# Altium schematic sheet CV_GATE_Current_Buffer.SchDoc: MIDI-CV Converter: GPIO Buffers
size Letter; Engineer: Nicholas Morrow; DocumentNumber: 2; SheetNumber: 2; SheetTotal: 5; Project: GARY Synthesizer
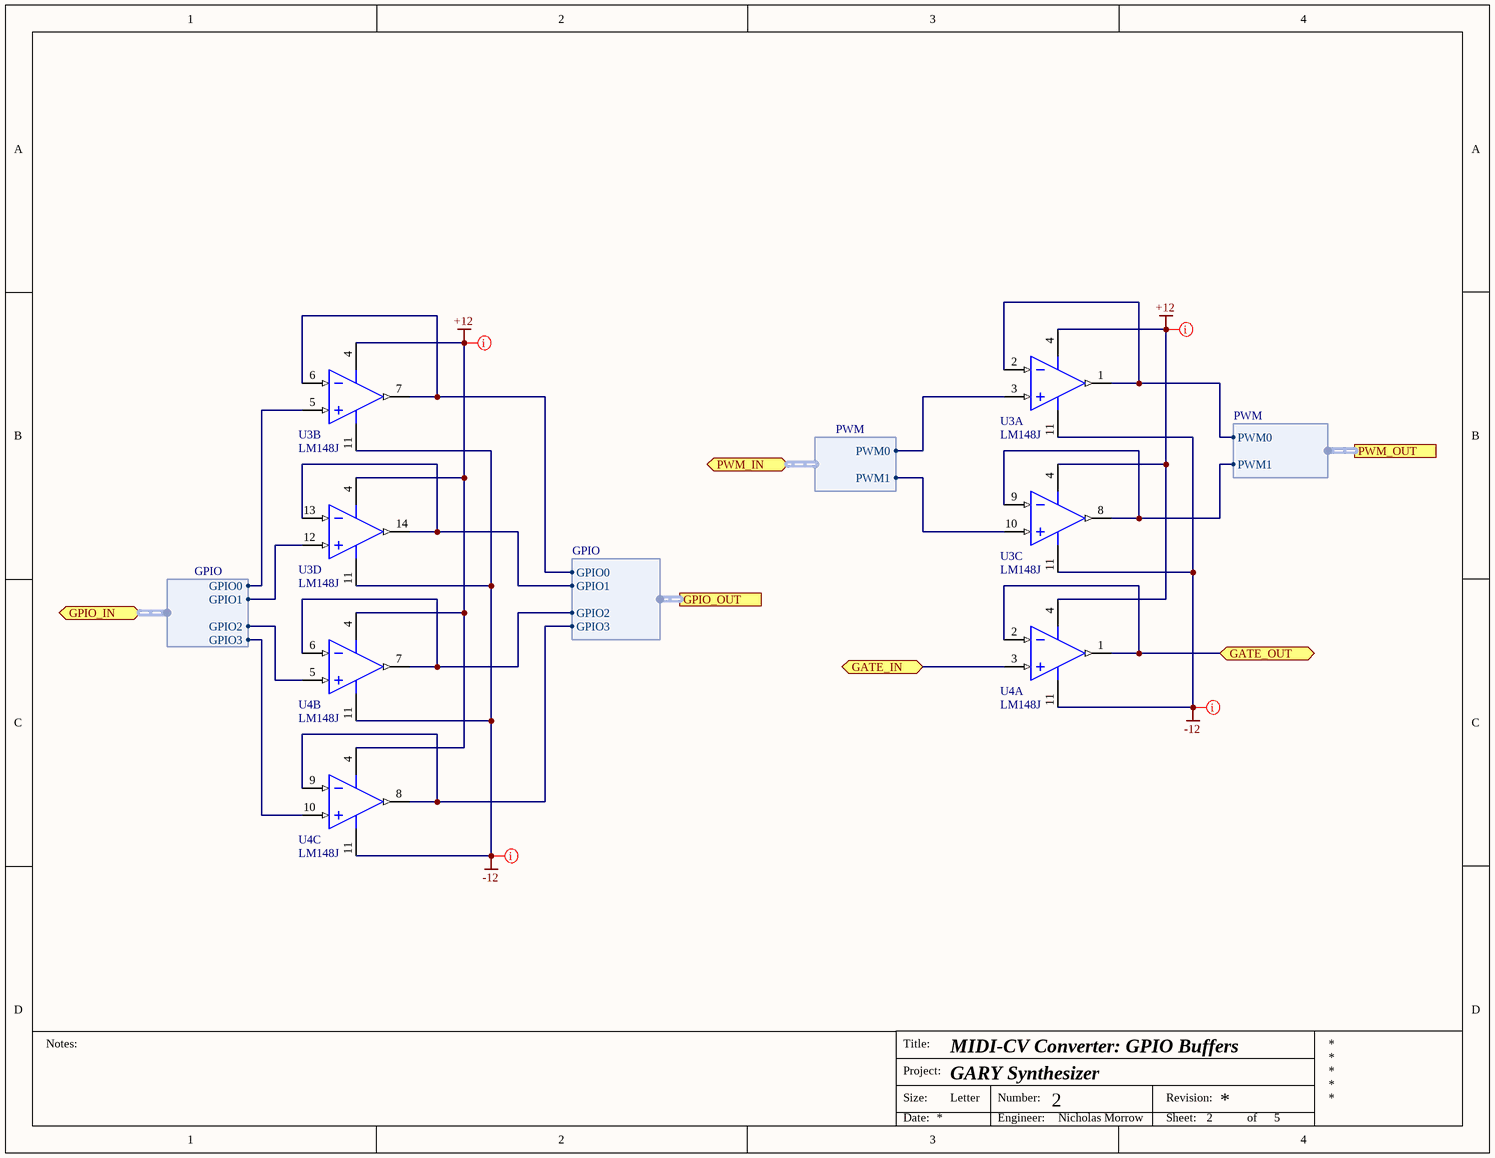
[diagram p0: CV_GATE_Current_Buffer.SchDoc]

## Parts
U3  LM148J  [J14A]  (parts A,B,C,D of 4)
U4  LM148J  [J14A]  (parts A,B,C of 4)

## Ports
GATE_IN, GATE_OUT, GPIO_IN (harness GPIO), GPIO_OUT (harness GPIO), PWM_IN (harness PWM), PWM_OUT (harness PWM)

## Harnesses
PWM: PWM0, PWM1
GPIO: GPIO0, GPIO1, GPIO2, GPIO3

## Nets
+12: U3.4(V+) U4.4(V+)
-12: U3.11(V-) U4.11(V-)
GATE_IN: U4.3(IN1+) ; port GATE_IN
GATE_OUT: U4.1(OUT1) U4.2(IN1-) ; port GATE_OUT
NetU3_1: U3.1(OUT1) U3.2(IN1-) ; port PWM_OUT.PWM0
NetU3_3: U3.3(IN1+) ; port PWM_IN.PWM0
NetU3_5: U3.5(IN2+) ; port GPIO_IN.GPIO0
NetU3_6: U3.6(IN2-) U3.7(OUT2) ; port GPIO_OUT.GPIO0
NetU3_8: U3.8(OUT3) U3.9(IN3-) ; port PWM_OUT.PWM1
NetU3_10: U3.10(IN3+) ; port PWM_IN.PWM1
NetU3_12: U3.12(IN4+) ; port GPIO_IN.GPIO1
NetU3_13: U3.13(IN4-) U3.14(OUT4) ; port GPIO_OUT.GPIO1
NetU4_5: U4.5(IN2+) ; port GPIO_IN.GPIO2
NetU4_6: U4.6(IN2-) U4.7(OUT2) ; port GPIO_OUT.GPIO2
NetU4_8: U4.8(OUT3) U4.9(IN3-) ; port GPIO_OUT.GPIO3
NetU4_10: U4.10(IN3+) ; port GPIO_IN.GPIO3

## Layout directives
net class Power: +12, -12

## Notes on the sheet
- Notes:
- Title:
- Size:
- Project:
- Letter
- Number:
- Revision:
- Date:
- Engineer:
- Sheet:
- of

## Library data of the parts
U3 U4 = LM148J: Series Quad 741 Op Amp, 14-pin CerDIP; Manufacturer: National Semiconductor; PackageTopMarking: NSUZXYYTT*LM148J; PowerWise: N; CompType: Amplifiers; High-Reliability: Y; DatasheetVersion: Nov-2003; PackageVersion: revJ, Jul-2002; PackageReference: J14A; PackageDescription: Cerdip, .400 x .310in Body, 14 Lead, .300in Centers, .100in Pitch; PartNumber: LM148J; RoHS: N; PinCount: 14; ComponentLink1Description: Manufacturer URL; ComponentLink1URL: http://www.national.com/; ComponentLink2Description: LM148 Datasheet; ComponentLink2URL: http://www.national.com/ds/LM/LM148.pdf; ComponentLink3Description: LM148 Web Page; ComponentLink3URL: http://www.national.com/pf/LM/LM148.html; ComponentLink4Description: J14A Package Page; ComponentLink4URL: http://www.national.com/packaging/folders/j14a.html